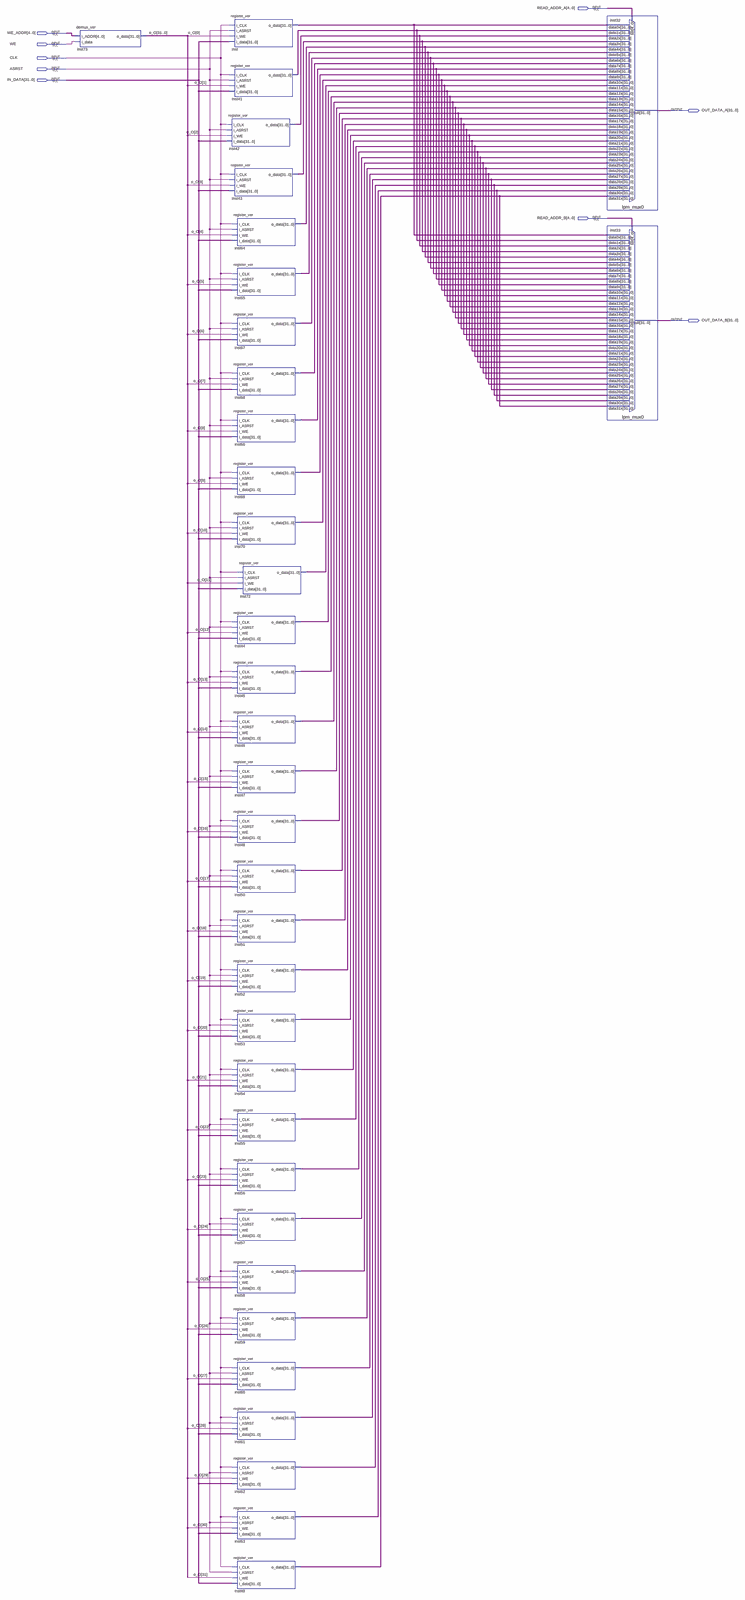
[diagram p0: schematic sheet, whole]
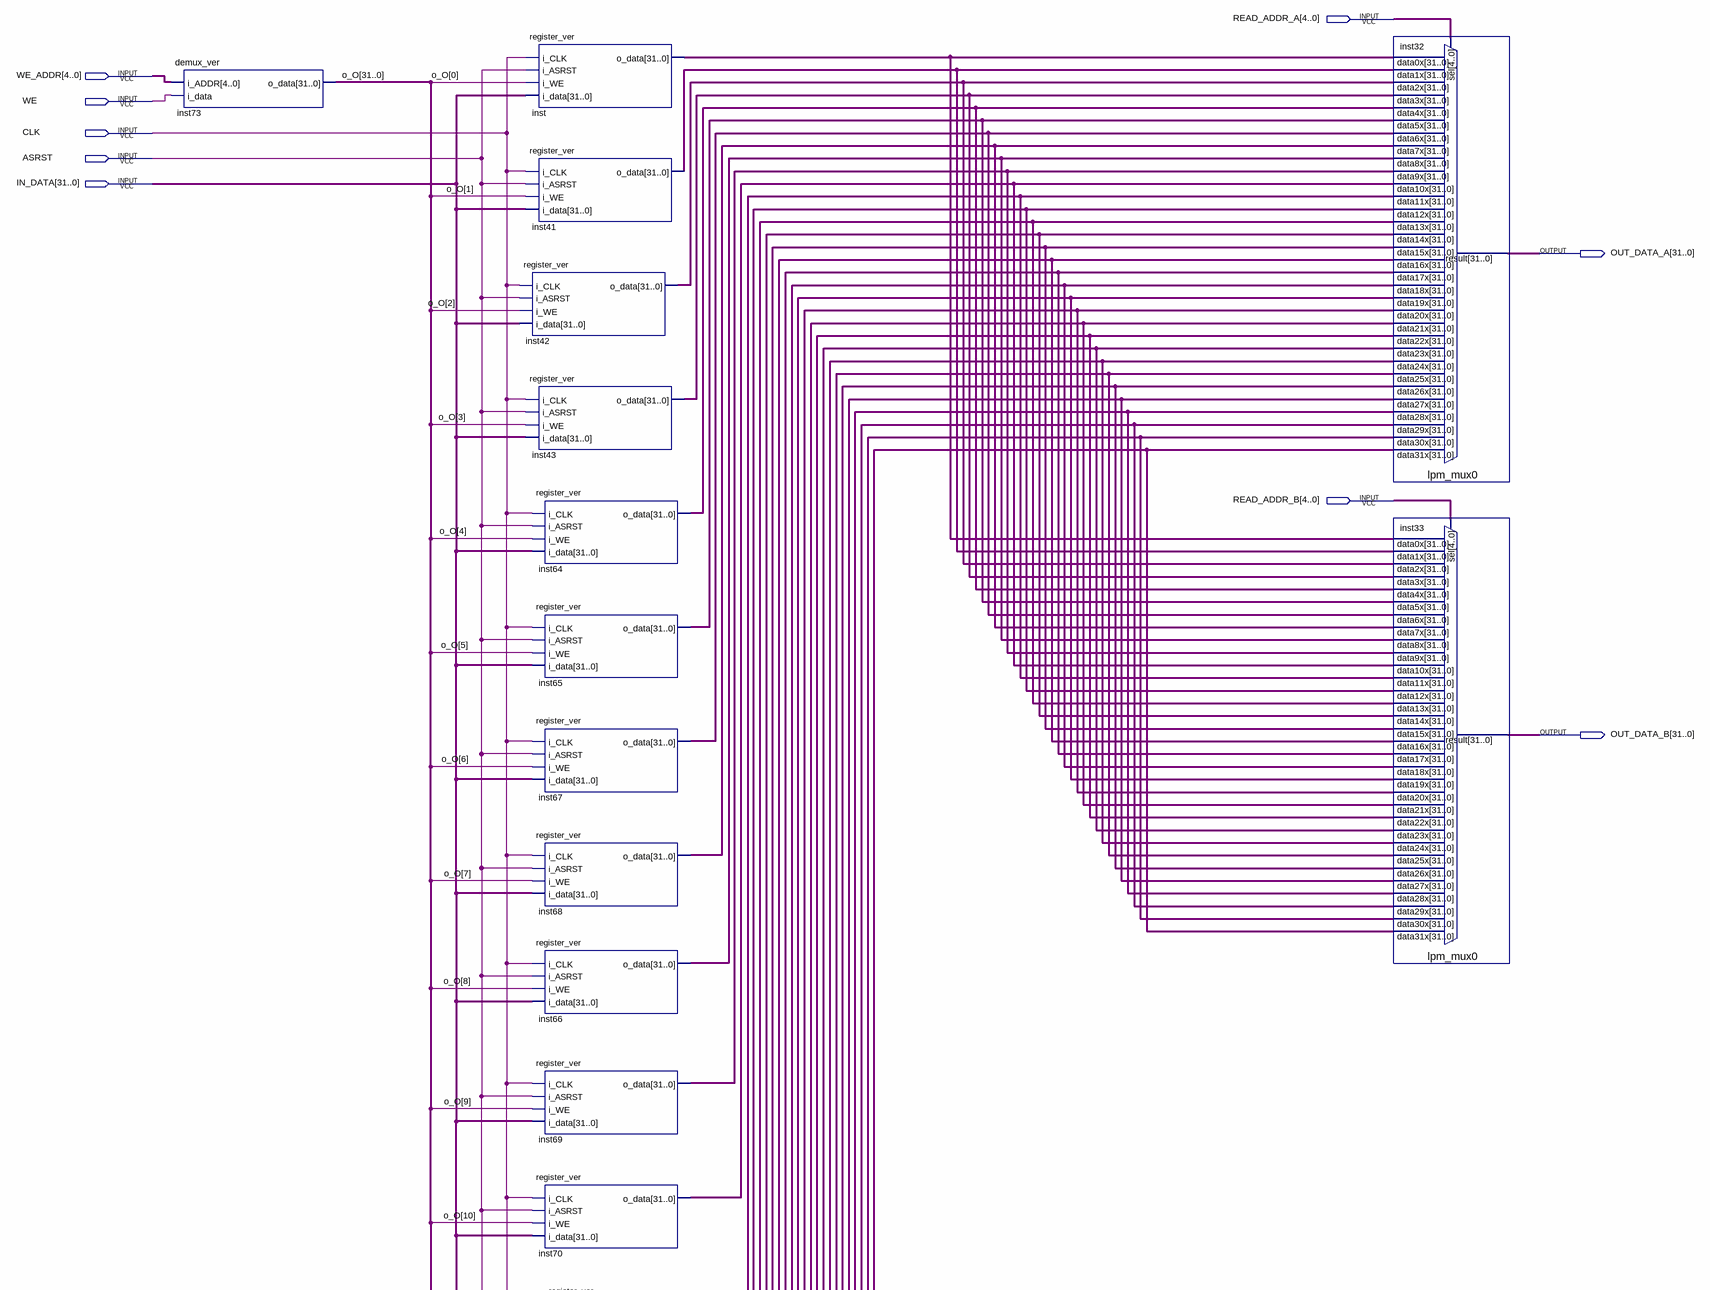
[diagram p1: schematic sheet, upper part]
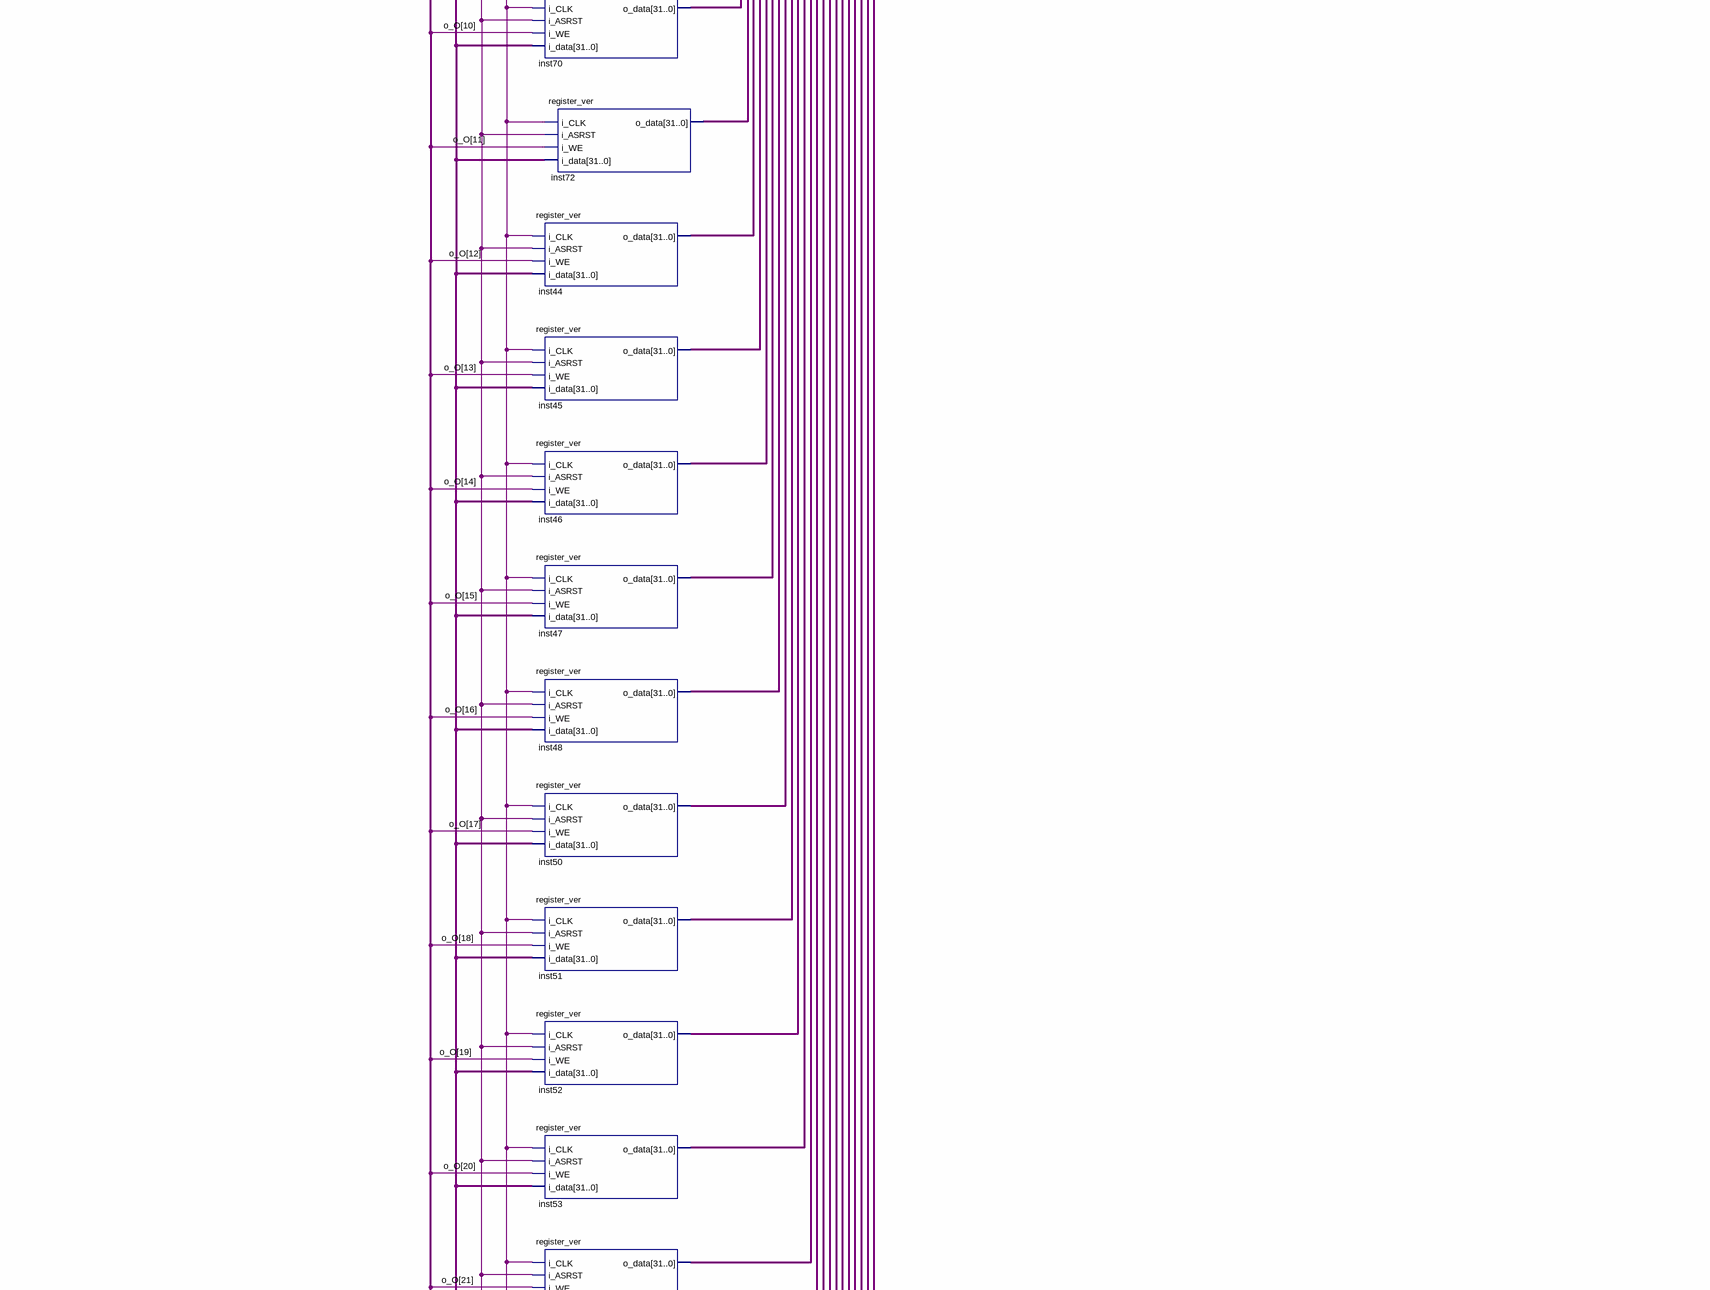
[diagram p2: schematic sheet, middle part]
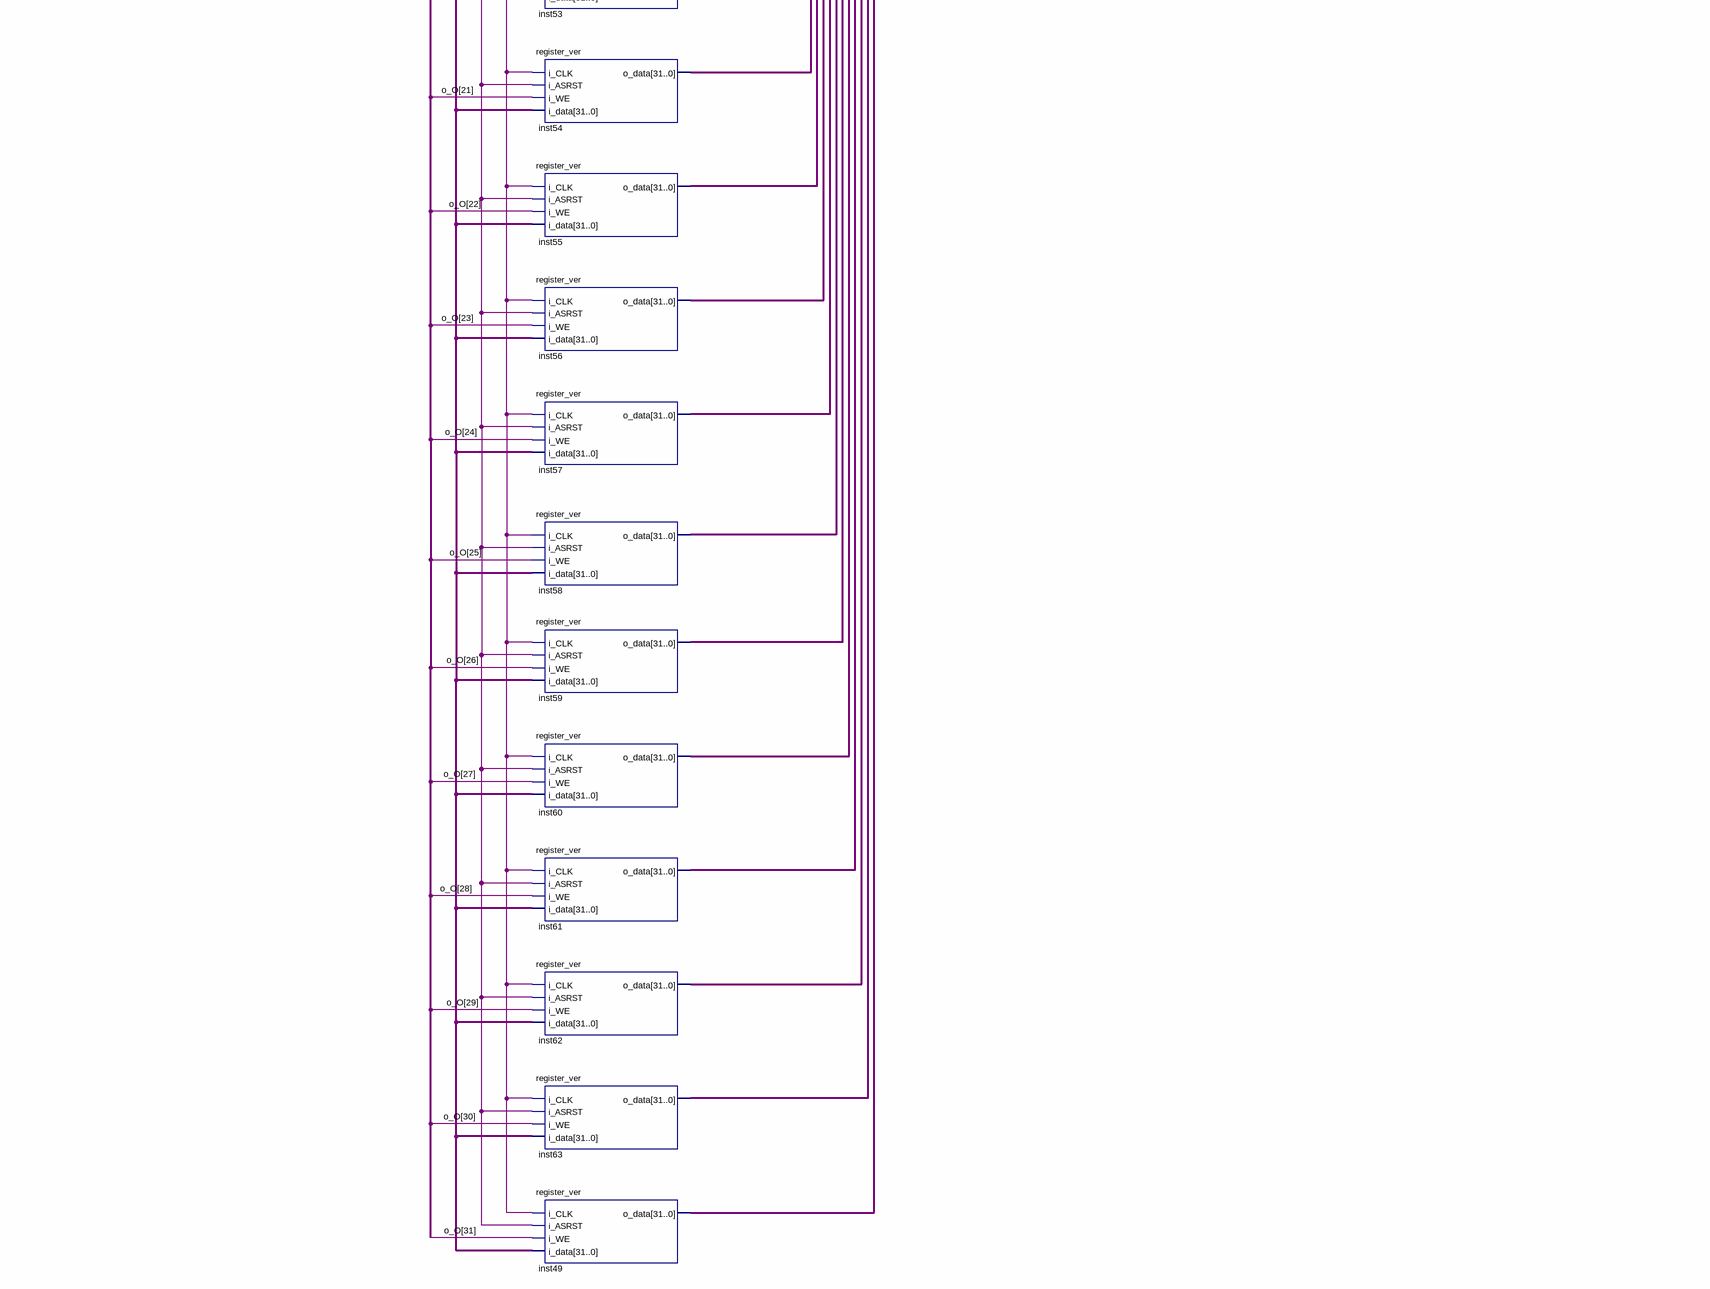
[diagram p3: schematic sheet, lower part]
// Quartus schematic register_file.bdf as structural Verilog: 35 symbols, 9 pins
module register_file (
  input  [4:0] READ_ADDR_A,
  input  [4:0] WE_ADDR,
  input  WE,
  input  CLK,
  input  ASRST,
  input  [31:0] IN_DATA,
  input  [4:0] READ_ADDR_B,
  output [31:0] OUT_DATA_A,
  output [31:0] OUT_DATA_B
);

  wire [31:0] inst41_o_data, inst42_o_data, inst43_o_data, inst44_o_data, inst45_o_data, inst46_o_data,
       inst47_o_data, inst48_o_data, inst49_o_data, inst50_o_data, inst51_o_data, inst52_o_data,
       inst53_o_data, inst54_o_data, inst55_o_data, inst56_o_data, inst57_o_data, inst58_o_data,
       inst59_o_data, inst60_o_data, inst61_o_data, inst62_o_data, inst63_o_data, inst64_o_data,
       inst65_o_data, inst66_o_data, inst67_o_data, inst68_o_data, inst69_o_data, inst70_o_data,
       inst72_o_data, inst_o_data, o_O;

  demux_ver inst73 (.i_ADDR(WE_ADDR), .i_data(WE), .o_data(o_O));
  register_ver inst (.i_CLK(CLK), .i_ASRST(ASRST), .i_WE(o_O[0]), .i_data(IN_DATA), .o_data(inst_o_data));
  register_ver inst41 (.i_CLK(CLK), .i_ASRST(ASRST), .i_WE(o_O[1]), .i_data(IN_DATA), .o_data(inst41_o_data));
  register_ver inst42 (.i_CLK(CLK), .i_ASRST(ASRST), .i_WE(o_O[2]), .i_data(IN_DATA), .o_data(inst42_o_data));
  register_ver inst43 (.i_CLK(CLK), .i_ASRST(ASRST), .i_WE(o_O[3]), .i_data(IN_DATA), .o_data(inst43_o_data));
  register_ver inst64 (.i_CLK(CLK), .i_ASRST(ASRST), .i_WE(o_O[4]), .i_data(IN_DATA), .o_data(inst64_o_data));
  register_ver inst65 (.i_CLK(CLK), .i_ASRST(ASRST), .i_WE(o_O[5]), .i_data(IN_DATA), .o_data(inst65_o_data));
  register_ver inst67 (.i_CLK(CLK), .i_ASRST(ASRST), .i_WE(o_O[6]), .i_data(IN_DATA), .o_data(inst67_o_data));
  register_ver inst68 (.i_CLK(CLK), .i_ASRST(ASRST), .i_WE(o_O[7]), .i_data(IN_DATA), .o_data(inst68_o_data));
  register_ver inst66 (.i_CLK(CLK), .i_ASRST(ASRST), .i_WE(o_O[8]), .i_data(IN_DATA), .o_data(inst66_o_data));
  register_ver inst69 (.i_CLK(CLK), .i_ASRST(ASRST), .i_WE(o_O[9]), .i_data(IN_DATA), .o_data(inst69_o_data));
  register_ver inst70 (.i_CLK(CLK), .i_ASRST(ASRST), .i_WE(o_O[10]), .i_data(IN_DATA), .o_data(inst70_o_data));
  register_ver inst72 (.i_CLK(CLK), .i_ASRST(ASRST), .i_WE(o_O[11]), .i_data(IN_DATA), .o_data(inst72_o_data));
  register_ver inst44 (.i_CLK(CLK), .i_ASRST(ASRST), .i_WE(o_O[12]), .i_data(IN_DATA), .o_data(inst44_o_data));
  register_ver inst45 (.i_CLK(CLK), .i_ASRST(ASRST), .i_WE(o_O[13]), .i_data(IN_DATA), .o_data(inst45_o_data));
  register_ver inst46 (.i_CLK(CLK), .i_ASRST(ASRST), .i_WE(o_O[14]), .i_data(IN_DATA), .o_data(inst46_o_data));
  register_ver inst47 (.i_CLK(CLK), .i_ASRST(ASRST), .i_WE(o_O[15]), .i_data(IN_DATA), .o_data(inst47_o_data));
  register_ver inst48 (.i_CLK(CLK), .i_ASRST(ASRST), .i_WE(o_O[16]), .i_data(IN_DATA), .o_data(inst48_o_data));
  register_ver inst50 (.i_CLK(CLK), .i_ASRST(ASRST), .i_WE(o_O[17]), .i_data(IN_DATA), .o_data(inst50_o_data));
  register_ver inst51 (.i_CLK(CLK), .i_ASRST(ASRST), .i_WE(o_O[18]), .i_data(IN_DATA), .o_data(inst51_o_data));
  register_ver inst52 (.i_CLK(CLK), .i_ASRST(ASRST), .i_WE(o_O[19]), .i_data(IN_DATA), .o_data(inst52_o_data));
  register_ver inst53 (.i_CLK(CLK), .i_ASRST(ASRST), .i_WE(o_O[20]), .i_data(IN_DATA), .o_data(inst53_o_data));
  register_ver inst54 (.i_CLK(CLK), .i_ASRST(ASRST), .i_WE(o_O[21]), .i_data(IN_DATA), .o_data(inst54_o_data));
  register_ver inst55 (.i_CLK(CLK), .i_ASRST(ASRST), .i_WE(o_O[22]), .i_data(IN_DATA), .o_data(inst55_o_data));
  register_ver inst56 (.i_CLK(CLK), .i_ASRST(ASRST), .i_WE(o_O[23]), .i_data(IN_DATA), .o_data(inst56_o_data));
  register_ver inst57 (.i_CLK(CLK), .i_ASRST(ASRST), .i_WE(o_O[24]), .i_data(IN_DATA), .o_data(inst57_o_data));
  register_ver inst58 (.i_CLK(CLK), .i_ASRST(ASRST), .i_WE(o_O[25]), .i_data(IN_DATA), .o_data(inst58_o_data));
  register_ver inst59 (.i_CLK(CLK), .i_ASRST(ASRST), .i_WE(o_O[26]), .i_data(IN_DATA), .o_data(inst59_o_data));
  register_ver inst60 (.i_CLK(CLK), .i_ASRST(ASRST), .i_WE(o_O[27]), .i_data(IN_DATA), .o_data(inst60_o_data));
  register_ver inst61 (.i_CLK(CLK), .i_ASRST(ASRST), .i_WE(o_O[28]), .i_data(IN_DATA), .o_data(inst61_o_data));
  register_ver inst62 (.i_CLK(CLK), .i_ASRST(ASRST), .i_WE(o_O[29]), .i_data(IN_DATA), .o_data(inst62_o_data));
  register_ver inst63 (.i_CLK(CLK), .i_ASRST(ASRST), .i_WE(o_O[30]), .i_data(IN_DATA), .o_data(inst63_o_data));
  register_ver inst49 (.i_CLK(CLK), .i_ASRST(ASRST), .i_WE(o_O[31]), .i_data(IN_DATA), .o_data(inst49_o_data));
  lpm_mux0 inst32 (
    .data31x(inst49_o_data), .data30x(inst63_o_data), .data29x(inst62_o_data), .data28x(inst61_o_data),
    .data27x(inst60_o_data), .data26x(inst59_o_data), .data25x(inst58_o_data), .data24x(inst57_o_data),
    .data23x(inst56_o_data), .data22x(inst55_o_data), .data21x(inst54_o_data), .data20x(inst53_o_data),
    .data19x(inst52_o_data), .data18x(inst51_o_data), .data17x(inst50_o_data), .data16x(inst48_o_data),
    .data15x(inst47_o_data), .data14x(inst46_o_data), .data13x(inst45_o_data), .data12x(inst44_o_data),
    .data11x(inst72_o_data), .data10x(inst70_o_data), .data9x(inst69_o_data), .data8x(inst66_o_data),
    .data7x(inst68_o_data), .data6x(inst67_o_data), .data5x(inst65_o_data), .data4x(inst64_o_data),
    .data3x(inst43_o_data), .data2x(inst42_o_data), .data1x(inst41_o_data), .data0x(inst_o_data),
    .sel(READ_ADDR_A), .result(OUT_DATA_A));
  lpm_mux0 inst33 (
    .data31x(inst49_o_data), .data30x(inst63_o_data), .data29x(inst62_o_data), .data28x(inst61_o_data),
    .data27x(inst60_o_data), .data26x(inst59_o_data), .data25x(inst58_o_data), .data24x(inst57_o_data),
    .data23x(inst56_o_data), .data22x(inst55_o_data), .data21x(inst54_o_data), .data20x(inst53_o_data),
    .data19x(inst52_o_data), .data18x(inst51_o_data), .data17x(inst50_o_data), .data16x(inst48_o_data),
    .data15x(inst47_o_data), .data14x(inst46_o_data), .data13x(inst45_o_data), .data12x(inst44_o_data),
    .data11x(inst72_o_data), .data10x(inst70_o_data), .data9x(inst69_o_data), .data8x(inst66_o_data),
    .data7x(inst68_o_data), .data6x(inst67_o_data), .data5x(inst65_o_data), .data4x(inst64_o_data),
    .data3x(inst43_o_data), .data2x(inst42_o_data), .data1x(inst41_o_data), .data0x(inst_o_data),
    .sel(READ_ADDR_B), .result(OUT_DATA_B));
endmodule
